# EAGLE design RH018.2 (EAGLE 7.1.0)
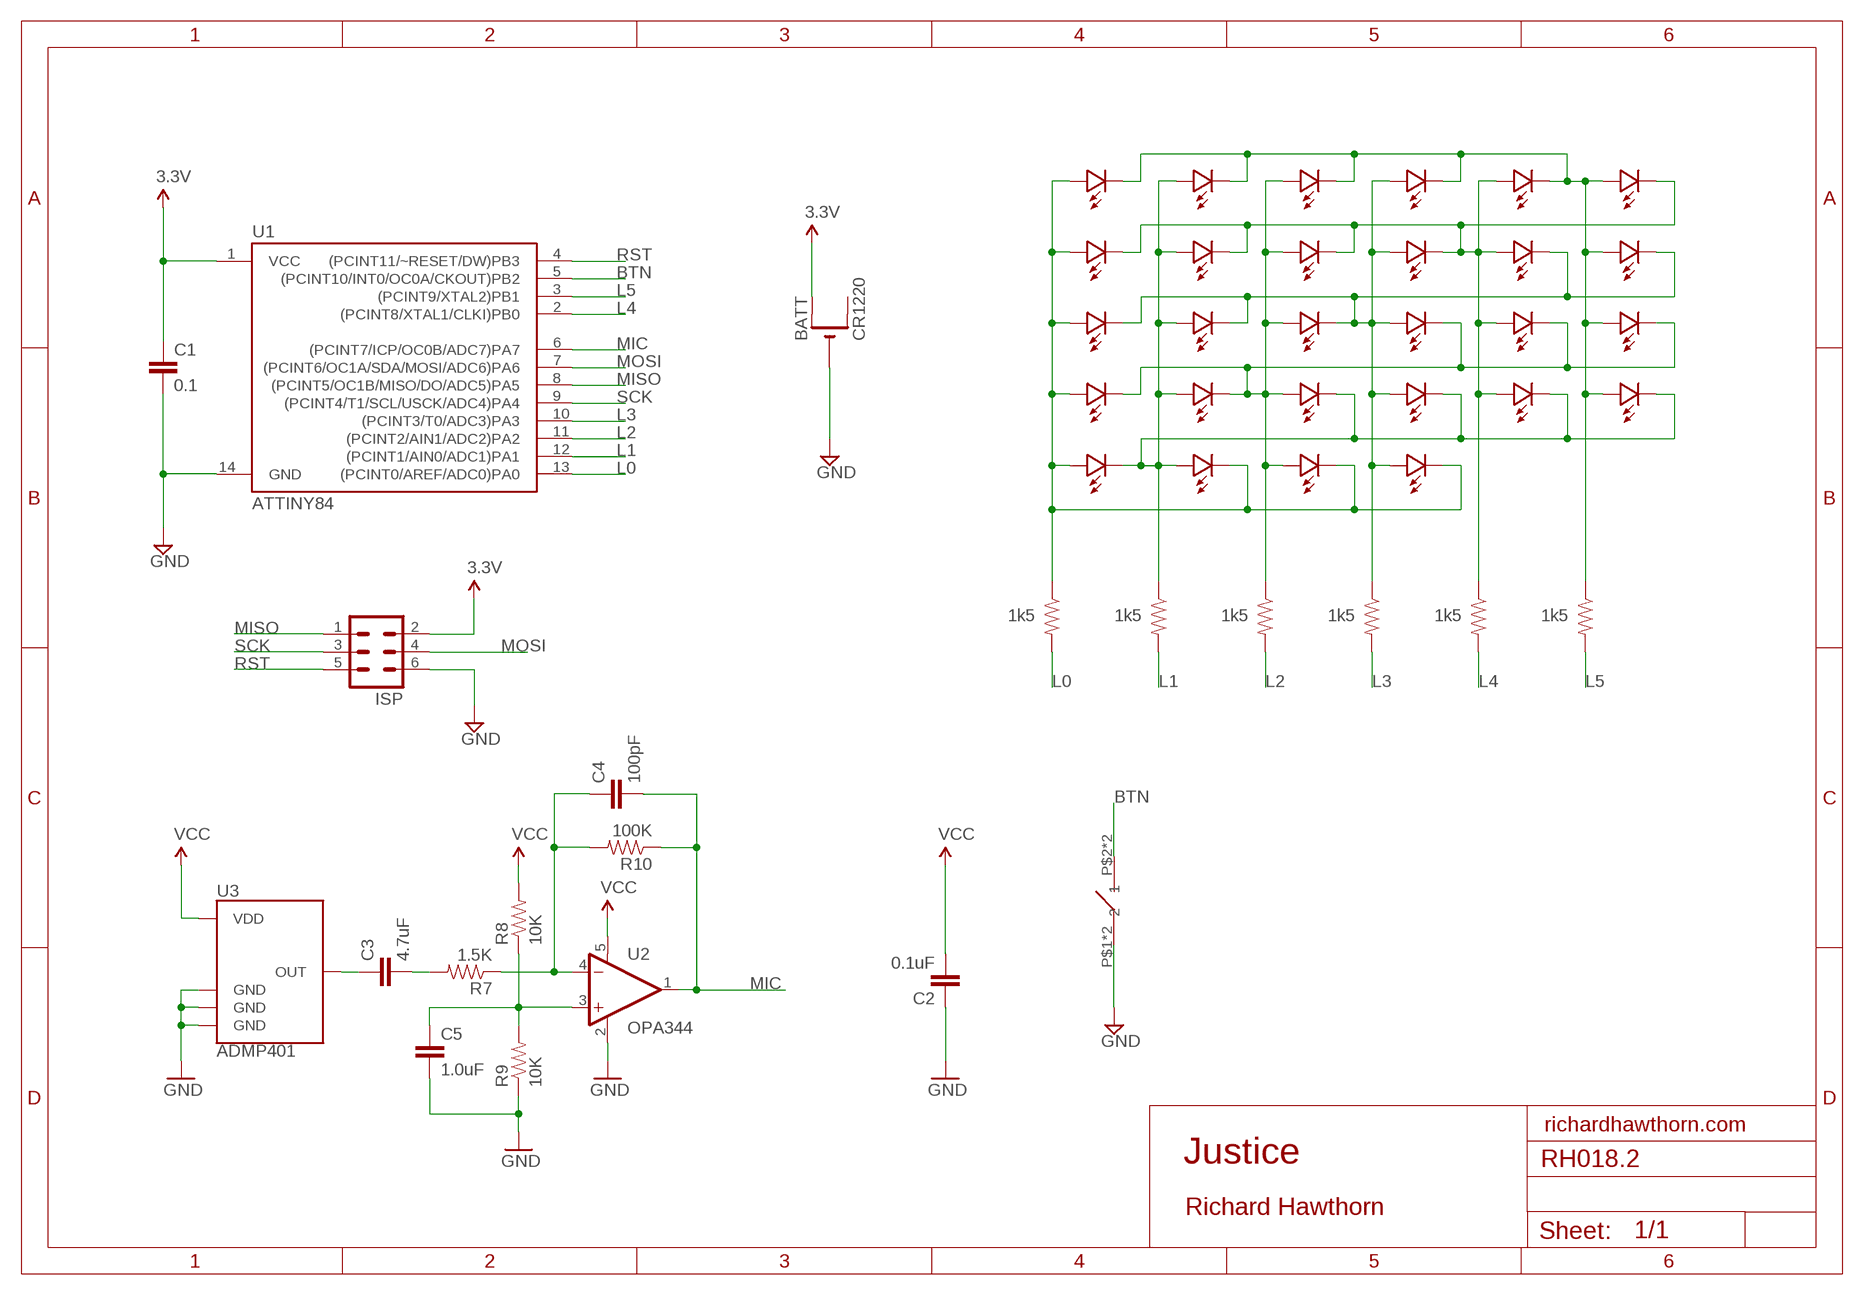
[diagram p0: schematic, sheet 1]

## Parts
BATT  CR1220  CR1220SMT  [CR1220-SMD]
BTN1  TURTLE-3PIN  [TURTLE-3PIN]
C1  0.1  CAP0603-CAP  [0603-CAP]
C2  0.1uF  CAP0402-CAP  [0402-CAP]
C3  4.7uF  CAP0402-CAP  [0402-CAP]
C4  100pF  CAP0402-CAP  [0402-CAP]
C5  1.0uF  CAP0402-CAP  [0402-CAP]
ISP  MA03-2  [MA03-2]
LED1  LED0603  [0603-LED]
LED2  LED0603  [0603-LED]
LED3  LED0603  [0603-LED]
LED4  LED0603  [0603-LED]
LED5  LED0603  [0603-LED]
LED6  LED0603  [0603-LED]
LED7  LED0603  [0603-LED]
LED8  LED0603  [0603-LED]
LED9  LED0603  [0603-LED]
LED10  LED0603  [0603-LED]
LED11  LED0603  [0603-LED]
LED12  LED0603  [0603-LED]
LED13  LED0603  [0603-LED]
LED14  LED0603  [0603-LED]
LED15  LED0603  [0603-LED]
LED16  LED0603  [0603-LED]
LED17  LED0603  [0603-LED]
LED18  LED0603  [0603-LED]
LED19  LED0603  [0603-LED]
LED20  LED0603  [0603-LED]
LED21  LED0603  [0603-LED]
LED22  LED0603  [0603-LED]
LED23  LED0603  [0603-LED]
LED24  LED0603  [0603-LED]
LED25  LED0603  [0603-LED]
LED26  LED0603  [0603-LED]
LED27  LED0603  [0603-LED]
LED28  LED0603  [0603-LED]
R1  1k5  RESISTOR0603-RES  [0603-RES]
R2  1k5  RESISTOR0603-RES  [0603-RES]
R3  1k5  RESISTOR0603-RES  [0603-RES]
R4  1k5  RESISTOR0603-RES  [0603-RES]
R5  1k5  RESISTOR0603-RES  [0603-RES]
R6  1k5  RESISTOR0603-RES  [0603-RES]
R7  1.5K  RESISTOR0402-RES  [0402-RES]
R8  10K  RESISTOR0402-RES  [0402-RES]
R9  10K  RESISTOR0402-RES  [0402-RES]
R10  100K  RESISTOR0402-RES  [0402-RES]
U1  ATTINY84  [SO14]
U2  OPA344  [SOT23-5]
U3  ADMP401  [ADMP401]

## Nets
BTN: BTN1.P$2 BTN1.P$4 U1.5((PCINT10/INT0/OC0A/CKOUT)PB2)
C7N$1: C3.1 U3.1(OUT)
GND [power]: BATT.- BTN1.P$1 BTN1.P$3 C1.2 C2.1 C5.2 ISP.6 R9.1 U1.14(GND) U2.2(V-) U3.2(GND) U3.4(GND) U3.6(GND)
L0: R1.2 U1.13((PCINT0/AREF/ADC0)PA0)
L1: R2.2 U1.12((PCINT1/AIN0/ADC1)PA1)
L2: R3.2 U1.11((PCINT2/AIN1/ADC2)PA2)
L3: R4.2 U1.10((PCINT3/T0/ADC3)PA3)
L4: R5.2 U1.2((PCINT8/XTAL1/CLKI)PB0)
L5: R6.2 U1.3((PCINT9/XTAL2)PB1)
MIC: C4.2 R10.1 U1.6((PCINT7/ICP/OC0B/ADC7)PA7) U2.1(OUT)
MISO: ISP.1 U1.8((PCINT5/OC1B/MISO/DO/ADC5)PA5)
MOSI: ISP.4 U1.7((PCINT6/OC1A/SDA/MOSI/ADC6)PA6)
N$2: C4.1 R7.1 R10.2 U2.4(-IN)
N$6: C3.2 R7.2
N$7: C5.1 R8.1 R9.2 U2.3(+IN)
N$8: LED1.MINUS LED2.MINUS LED3.MINUS LED4.MINUS LED5.MINUS LED6.PLUS LED12.PLUS LED18.PLUS LED24.PLUS R6.1
N$12: LED2.PLUS LED8.PLUS LED14.PLUS LED20.PLUS LED21.MINUS LED22.MINUS LED23.MINUS LED24.MINUS LED25.MINUS LED26.PLUS R2.1
N$22: LED1.PLUS LED7.PLUS LED13.PLUS LED19.PLUS LED25.PLUS LED26.MINUS LED27.MINUS LED28.MINUS R1.1
N$32: LED5.PLUS LED6.MINUS LED7.MINUS LED8.MINUS LED9.MINUS LED10.MINUS LED11.PLUS LED17.PLUS LED23.PLUS R5.1
N$41: LED4.PLUS LED10.PLUS LED11.MINUS LED12.MINUS LED13.MINUS LED14.MINUS LED15.MINUS LED16.PLUS LED22.PLUS LED28.PLUS R4.1
N$50: LED3.PLUS LED9.PLUS LED15.PLUS LED16.MINUS LED17.MINUS LED18.MINUS LED19.MINUS LED20.MINUS LED21.PLUS LED27.PLUS R3.1
RST: ISP.5 U1.4((PCINT11/~RESET/DW)PB3)
SCK: ISP.3 U1.9((PCINT4/T1/SCL/USCK/ADC4)PA4)
VCC: BATT.+$1(+) C1.1 C2.2 ISP.2 R8.2 U1.1(VCC) U2.5(V+) U3.5(VDD) ; supply symbol labelled 3.3V
Unconnected: BATT.+$2(+1)

## Notes on the sheet
- richardhawthorn.com
- Justice
- Richard Hawthorn

## Library data of the parts
BATT = adafruit:CR1220: CR1216/CR1220/CR1225 12mm 3V lithium coin cell Great for battery packup. Both SMT and THM holders. Note the THM package has the ground pads on both sides of the PCB so that the masks are the same - this reduces the cost
BTN1 = Richards:TURTLE-3PIN
C1 = LowPowerLab:CAP: Capacitor Standard 0603 ceramic capacitor, and 0.1" leaded capacitor.
C2-C5 = SparkFun:CAP: Capacitor Standard 0603 ceramic capacitor, and 0.1" leaded capacitor.
ISP = Richards:MA03-2: PIN HEADER; OC_FARNELL: unknown; OC_NEWARK: unknown
LED1-LED28 = LowPowerLab:LED
R1-R6 = LowPowerLab:RESISTOR: Resistor
R7-R10 = SparkFun:RESISTOR: Resistor
U1 = SparkFun-DigitalIC:ATTINY84: Atmel 14-pin 2/4/8kB flash uC
U2 = SparkFun:OPA344
U3 = SparkFun:ADMP401

## Net classes
1 power: width 0.381 mm, clearance 0.254 mm

## Board
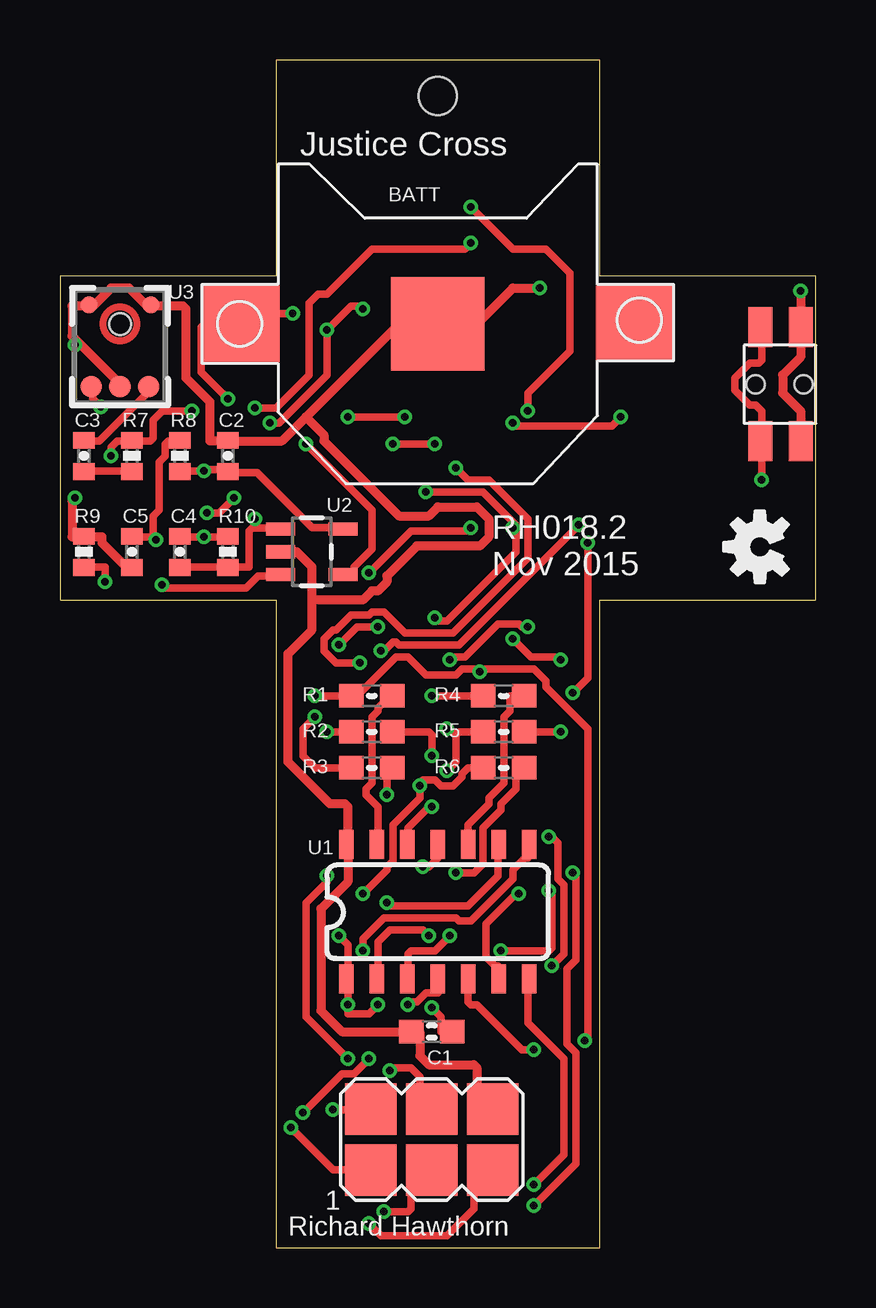
[diagram p1: board, top side]
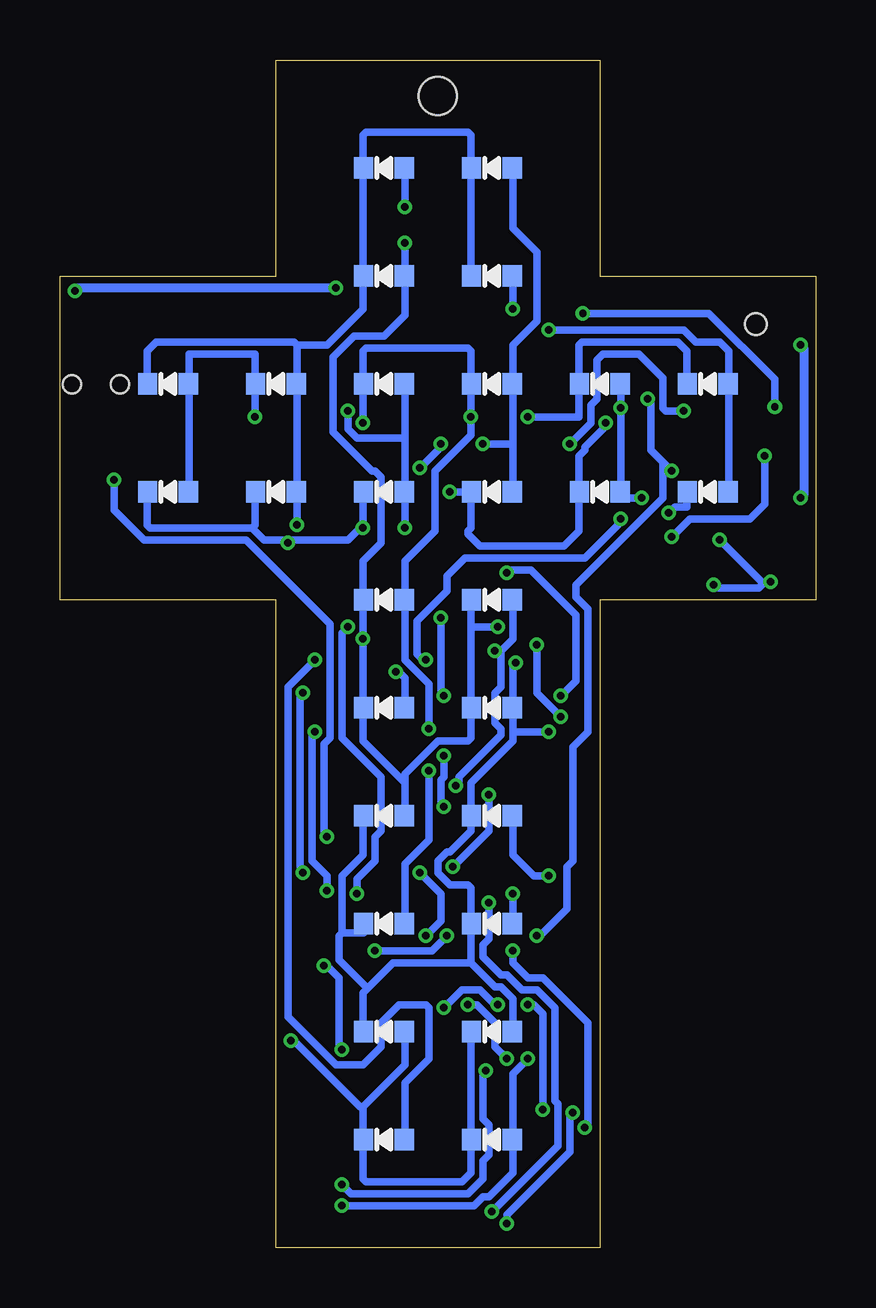
[diagram p2: board, bottom side, seen from below]

Size 31.5 x 49.5 mm. Coordinates in mm from the lower left corner, seen from the top.
Outline: 31.5,27 31.5,40.5 22.5,40.5 22.5,49.5 9,49.5 9,40.5 0,40.5 0,27 9,27 9,0 22.5,0 22.5,27 31.5,27
Copper layers (1*16): Top 0.035mm / dielectric 1.5mm / Bottom 0.035mm
Design rules "ITEADstudio_DRC *": minimum track width 12mil, minimum drill 12mil, track to track 6mil, track to pad 6mil, pad to pad 6mil, via to via 6mil, smd to smd 0mil, copper to edge 10mil, drill to drill 10mil, minimum pad ring 10mil, minimum via ring 6mil, stop-mask expansion 2mil, vias tented up to drill 100mil, thermal gap 15mil
Holes 1.6 mm at 15.75,48
tRestrict: area 22.8,8.4 to 27.6,12.3; area 4.3,16.4 to 5.4,18; area 3.7,9.2 to 5.2,9.9
bRestrict: area 25.9,17.2 to 27.7,18.2; area 19.6,13.3 to 21.4,14.4; area 20.1,12.1 to 20.6,12.7; area 19.2,12.1 to 19.7,12.7; area 18.7,12.3 to 19.2,13; area 18.6,12.9 to 19.1,13.5; area 25,18.4 to 25.6,19; area 25,17.4 to 25.6,18; area 26,18.6 to 26.5,19.3; area 26.4,18.3 to 27.6,19.1

### Footprints (pad centres in the part's own frame; a part is rotated, then mirrored left to right if it is on the bottom)
CR1220-SMD = smd 3.2 x 3.2: +$1 -8.2,0; +$2 8.2,0 | smd 3.9 x 3.9: - 0,0
TURTLE-3PIN = smd 1.676 x 1: P$1 -2.39,-0.889; P$2 -2.39,0.811; P$3 2.36,-0.889; P$4 2.36,0.811 | hole 0.75: -0.015,-1; -0.015,1
0603-CAP = smd 1.016 x 0.965: 1 -0.85,0; 2 0.85,0
0402-CAP = smd 0.7 x 0.9: 1 -0.65,0; 2 0.65,0
MA03-2 = smd 2.159 x 2.159: 1 -2.54,-1.27; 2 -2.54,1.27; 3 0,-1.27; 4 0,1.27; 5 2.54,-1.27; 6 2.54,1.27
0603-LED = smd 0.8 x 0.9: MINUS -0.85,0; PLUS 0.85,0
0603-RES = smd 1.016 x 0.965: 1 -0.85,0; 2 0.85,0
0402-RES = smd 0.7 x 0.9: 1 -0.65,0; 2 0.65,0
SO14 = smd 0.6 x 1.2: 1 -3.81,-2.8; 2 -2.54,-2.8; 3 -1.27,-2.8; 4 0,-2.8; 5 1.27,-2.8; 6 2.54,-2.8; 7 3.81,-2.8; 8 3.81,2.8; 9 2.54,2.8; 10 1.27,2.8; 11 0,2.8; 12 -1.27,2.8; 13 -2.54,2.8; 14 -3.81,2.8
SOT23-5 = smd 0.55 x 1.2: 1 -0.95,-1.3; 2 0,-1.3; 3 0.95,-1.3; 4 0.95,1.3; 5 -0.95,1.3
ADMP401 = smd 0.9 x 0.9: 1 -1.2,2.62; 5 1.2,2.62; 6 0,2.62 | smd 0.7 x 0.7: 2 1.3,-0.8; 4 -1.3,-0.8 | hole 0.9: 0,0

### Placement (x,y rotation side)
BATT  15.75,38.5 0 top
BTN1  30,36 90 top
C1  15.5,9 180 top
C2  7,33 270 top
C3  1,33 270 top
C4  5,29 270 top
C5  3,29 270 top
ISP  15.5,4.5 0 top
LED1  18,45 0 bottom
LED2  13.5,45 0 bottom
LED3  18,40.5 0 bottom
LED4  13.5,40.5 0 bottom
LED5  27,36 0 bottom
LED6  22.5,36 0 bottom
LED7  18,36 0 bottom
LED8  13.5,36 0 bottom
LED9  9,36 0 bottom
LED10  4.5,36 0 bottom
LED11  27,31.5 0 bottom
LED12  22.5,31.5 0 bottom
LED13  18,31.5 0 bottom
LED14  13.5,31.5 0 bottom
LED15  9,31.5 0 bottom
LED16  4.5,31.5 0 bottom
LED17  18,27 0 bottom
LED18  13.5,27 0 bottom
LED19  18,22.5 0 bottom
LED20  13.5,22.5 0 bottom
LED21  18,18 0 bottom
LED22  13.5,18 0 bottom
LED23  18,13.5 0 bottom
LED24  13.5,13.5 0 bottom
LED25  18,9 0 bottom
LED26  13.5,9 0 bottom
LED27  18,4.5 0 bottom
LED28  13.5,4.5 0 bottom
R1  13,23 0 top
R2  13,21.5 0 top
R3  13,20 0 top
R4  18.5,23 0 top
R5  18.5,21.5 0 top
R6  18.5,20 0 top
R7  3,33 270 top
R8  5,33 270 top
R9  1,29 270 top
R10  7,29 90 top
U1  15.75,14 0 top
U2  10.5,29 270 top
U3  2.5,38.5 180 top
U$3  [OSHW-LOGO-S]  29.17,29.21 90 top

### Tracks (layer width: path | path; a pad name or v marks a point on that pad's centre or on a via)
BTN  (via drill 0.3)
  Top 0.305: BTN1.P$4 29.25,38.25 29.25,37 29.12,36.88 28.75,36.88 28.12,36.25 28.12,35.75 28.75,35.12 29,35.12 29.25,34.88 29.25,33.62 BTN1.P$2 29.25,33.5 v29.25,32 | v19.75,8.25 19.25,8.25 17.38,10.12 17.12,10.12 17,10.25 17,11.12 U1.5 | v20.5,11.75 21,12.25 21,15.12 20.75,15.38 20.75,16.88 20.5,17.12 v20.38,17.12
  Bottom 0.305: v19.75,8.25 19.88,8.38 19.88,11.25 20.38,11.75 v20.5,11.75 | v20.38,17.12 20.5,17.25 20.5,21 20.25,21.25 20.25,26 23.75,29.5 28,29.5 29.25,30.75 v29.25,32
C7N$1
  Top 0.305: C3.1 1,33.62 1.62,33.62 3.88,35.88 3.75,36 U3.1
GND  (via drill 0.3)
  Top 0.381: U2.2 9.88,29 10.5,28.38 10.5,27 | 10.5,27 10.5,25.75 9.5,24.75 9.5,20.25 11.25,18.5 11.88,18.5 12,18.38 12,16.88 U1.14 12,16.75 12,15.25 10.88,14.12 10.88,9.88 11.75,9 C1.2 15,9 15,8 15.38,7.62 17.25,7.62 17.38,7.5 17.38,5.75 18,5.75 ISP.6 | C5.2 3,28.38 2.75,28.38 1.75,29.38 1.75,29.62 1,29.62 R9.1 0.88,29.62 0.5,29.62 0.5,31.12 v0.62,31.25 | 0.75,37.75 0.5,38 0.5,39.25 1.12,39.25 U3.2 1.25,39.25 1.38,39.25 2.12,40 2.88,40 3.62,39.25 3.75,39.25 U3.4 3.88,39.25 5.12,39.25 5.25,39.12 5.25,36.25 6.25,35.25 6.25,33.62 6.88,33.62 C2.1 7,33.62 9.25,33.62 10.25,34.62 | 0.75,37.75 2.5,36 U3.6 | v0.62,37.62 0.75,37.75 | BTN1.P$1 30.88,33.62 30.88,34.88 30.12,35.62 30.12,36.38 30.88,37.12 30.88,38.25 BTN1.P$3 30.88,38.5 v30.88,39.88 | 10.25,34.62 14.12,38.5 BATT.- 17.38,38.5 18.88,40 v20,40 | 10.5,27 12.62,27 13,27.38 13.25,27.38 13.62,27.75 13.62,28 14.88,29.25 17.5,29.25 17.88,29.62 17.88,30.38 17.38,30.88 15.75,30.88 15.38,30.5 14.12,30.5 11,33.62 11,33.88 10.25,34.62
  Bottom 0.381: v0.62,31.25 0.5,31.38 0.5,37.5 v0.62,37.62 | v30.88,39.88 30.75,40 v20,40
L0
  Top 0.305: R1.2 13.75,23 13.25,22.5 13.25,22.38 13,22.12 13,19.38 12.75,19.12 12.75,18.88 13.25,18.38 13.25,16.88 U1.13
L1  (via drill 0.3)
  Top 0.305: v15.5,18.38 15.38,18.38 14.5,17.5 14.5,16.88 U1.12 | v15.5,20.5 15.5,21.38 15.38,21.5 R2.2
  Bottom 0.305: v15.5,18.38 15.62,18.5 15.62,19.5 15.5,19.62 v15.5,20.5
L2  (via drill 0.3)
  Top 0.305: U1.11 15.75,16.25 15.38,15.88 v15.12,15.88 | v13.62,18.88 13.62,20 R3.2
  Bottom 0.305: v15.12,15.88 13.62,17.38 v13.62,18.88
L3
  Top 0.305: R4.2 18.75,23 18.75,22.38 18.5,22.12 18.5,19.38 17.88,18.75 17.88,18.5 17,17.62 17,16.88 U1.10
L4  (via drill 0.3)
  Top 0.305: v15.38,13 15.12,13.25 13.75,13.25 13.25,12.75 13.25,11.25 U1.2 | v18.38,12.38 20.38,12.38 20.5,12.5 20.5,14.75 v20.38,14.88 | R5.2 v20.88,21.5
  Bottom 0.305: v15.38,13 16,12.38 v18.38,12.38 | v20.38,14.88 20.38,15.5 21,16.12 21,21.38 v20.88,21.5
L5  (via drill 0.3)
  Top 0.305: R6.2 19,20 19,19.12 18.38,18.5 18.38,18.25 17.62,17.5 17.62,16 17.25,15.62 v16.5,15.62 | v16.25,13 15.62,12.38 14.62,12.38 14.5,12.25 14.5,11.25 U1.3
  Bottom 0.305: v16.5,15.62 15.62,14.75 15.62,13.62 v16.25,13
MIC  (via drill 0.3)
  Top 0.305: C4.2 5,28.38 7,28.38 R10.1 7.12,28.38 7.88,28.38 7.88,29.88 8,30 8.12,30 | 8.12,30 9.12,30 U2.1 | v19.12,14.75 19,14.75 17.75,13.5 17.75,12.12 18.12,11.75 18.25,11.75 18.25,11.25 U1.6 | v19.5,25.88 19.25,25.88 19.12,26 18.25,26 16.88,24.62 16.38,24.62 v16.25,24.5 | 8.12,30 v8.12,30.38
  Bottom 0.305: v19.12,14.75 19.12,15.38 18.38,16.12 18.38,17.12 18.12,17.38 18.12,19.62 19.75,21.25 19.75,25.62 v19.5,25.88 | v16.25,24.5 16.38,24.5 16.62,24.75 16.62,26.12 15.38,27.38 15.38,28 14.62,28.75 9.62,28.75 8.25,30.12 8.25,30.25 v8.12,30.38
MISO  (via drill 0.3)
  Top 0.305: v12.62,12.38 12.62,12.88 13.5,13.75 16.5,13.75 16.62,13.62 17.12,13.62 18.88,15.38 18.88,15.75 19.38,16.25 19.5,16.25 19.5,16.75 U1.8 | v9.62,5 11.38,3.25 12.88,3.25 ISP.1
  Bottom 0.305: v12.62,12.38 12.62,11.88 12,11.25 11.38,11.25 9.5,9.38 9.5,5.12 v9.62,5
MOSI  (via drill 0.3)
  Top 0.305: v19.75,2.62 21,3.88 21,7.88 19.5,9.38 19.5,11.12 U1.7 | v13.75,7.38 13.88,7.5 14.62,7.5 15,7.12 15,5.75 15.5,5.75 ISP.4
  Bottom 0.305: v19.75,2.62 19.38,2.25 14.5,2.25 13.88,2.88 13.88,3.62 13.62,3.88 13.62,5.12 13.88,5.38 13.88,7.25 v13.75,7.38
N$2  (via drill 0.3)
  Top 0.305: C4.1 5,29.62 v6,29.62 7,29.62 R10.2 | v2.12,33 2.12,33.38 2.38,33.62 3,33.62 R7.1 3.12,33.62 3.75,33.62 3.88,33.75 3.88,34.5 4.25,34.88 v5.5,34.88 | v10.25,33.5 13,30.75 13,29.12 12.25,28.38 12.25,28 11.88,28 U2.4
  Bottom 0.305: v2.12,33 2.12,31 2.75,30.38 5.25,30.38 v6,29.62 | v10.25,33.5 9.38,34.38 9.38,35.12 9.12,35.38 9.12,37 8.88,37.25 7.38,37.25 6.38,36.25 6.38,35 6.25,34.88 v5.5,34.88
N$6
  Top 0.305: C3.2 1,32.38 3,32.38 R7.2
N$7  (via drill 0.3)
  Top 0.305: v1.88,27.75 1.88,28.38 1,28.38 R9.2 | C5.1 3,29.62 3.88,29.62 v4,29.5 3.88,29.75 3.88,30.5 4.12,30.75 4.12,32.75 4.38,33 4.38,33.5 4.5,33.62 5,33.62 R8.1 | v4.25,27.62 4.38,27.5 7.75,27.5 8.25,28 9.12,28 U2.3
  Bottom 0.305: 2.25,27.75 v1.88,27.75 | v4,29.5 2.25,27.75 | v4.25,27.62 4.12,27.5 2.38,27.5 2.25,27.62 2.25,27.75
N$8  (via drill 0.3)
  Top 0.305: v12.62,14.75 13.62,15.75 13.62,15.88 13.88,16.12 13.88,17.62 15,18.75 v15,19.25 15,19.38 15.12,19.5 15.62,19.5 15.88,19.25 16.38,19.25 16.75,19.62 16.75,19.75 17,20 R6.1 | v13.38,24.88 13.5,24.88 13.88,25.25 14,25.25 14.12,25.12 16.62,25.12 v21.62,30.12
  Bottom 0.305: v12.62,14.75 12.62,13.5 LED24.PLUS | v15,19.25 14.88,19.38 14.88,19.62 13.12,21.38 13.12,21.62 13.38,21.88 13.38,23.12 13.12,23.38 13.12,24.88 | 13.12,24.88 12.62,25.38 12.62,27 LED18.PLUS | LED4.MINUS 14.38,40.5 14.38,45 LED2.MINUS 14.38,45.12 14.38,46.38 14.5,46.5 18.75,46.5 18.88,46.38 18.88,45.12 LED1.MINUS 18.88,45 18.88,40.5 LED3.MINUS 18.88,40.38 18.88,39.12 20.38,37.62 21.62,37.62 | 21.62,37.62 21.75,37.75 27.5,37.75 27.88,37.38 27.88,36 LED5.MINUS | 21.62,37.62 21.62,36.12 LED6.PLUS 21.62,36 21.62,31.5 LED12.PLUS 21.62,31.38 v21.62,30.12 | v13.38,24.88 13.12,24.88
N$12  (via drill 0.3)
  Top 0.305: v11.12,21.5 R2.1 | v15.62,33.5 v13.88,33.5 | v16.5,32.5 17,32 17.88,32 19.5,30.38 19.5,28.75 16.38,25.62 14.38,25.62 13.5,26.5 13,26.5 12.88,26.38 12.12,26.38 11.5,25.75 11.38,25.75 11,25.38 11,24.88 11.5,24.38 v12.5,24.38
  Bottom 0.305: 12.62,33.5 12.62,36 LED8.PLUS 12.62,36.12 12.62,37.62 11.62,38.62 11.62,41.5 12.62,42.5 12.62,45 LED2.PLUS | 12.62,33.5 12.62,31.5 LED14.PLUS | 12.62,21.5 12.62,21.12 14.38,19.38 14.38,18 LED22.MINUS 14.38,17.88 14.38,17.38 15.25,16.5 15.38,16.5 15.75,16.12 15.75,15.62 15.25,15.12 14.5,15.12 14.38,15 14.38,13.62 LED24.MINUS 14.38,13.5 14.38,11.88 | 12.62,21.5 12.62,22.5 LED20.PLUS 12.62,22.62 12.62,24.25 v12.5,24.38 | 12.62,21.5 v11.12,21.5 | 14.38,11.88 13.38,10.88 13.12,10.88 12.62,10.38 12.62,9 LED26.PLUS | 18.69,10.81 17.62,11.88 14.38,11.88 | 18.69,10.81 18.88,10.62 18.88,9 LED25.MINUS | 19.75,13.12 19.75,15.5 18.88,16.38 18.88,18 LED21.MINUS | 19.75,13.12 19.88,13 19.88,12 18.69,10.81 | v13.88,33.5 12.62,33.5 | v15.62,33.5 15.62,33.38 v16.5,32.5 | 19.75,13.12 18.85,13.12 LED23.MINUS
N$22  (via drill 0.3)
  Top 0.305: v17.12,43.38 18.88,41.62 20.25,41.62 21.25,40.62 21.25,37.38 19.5,35.62 v19.5,34.88 | v10.62,23 R1.1 12.38,23 14,24.62 14.5,24.62 15.25,23.88 16.5,23.88 16.75,24.12 17.38,24.12 v17.5,24 17.5,24.12 19.75,24.12 20.25,23.62 20.25,23.38 22,21.62 22,8.75 v21.88,8.62 | v12.88,28.12 14.62,29.88 17,29.88 v17.12,30
  Bottom 0.305: LED26.MINUS 14.38,9 14.38,4.5 LED28.MINUS 14.38,4.38 14.38,3.12 14.75,2.75 18.75,2.75 18.88,2.88 18.88,4.38 LED27.MINUS 18.88,4.5 18.88,5.88 | 18.88,5.88 17.12,7.62 17.12,9 LED25.PLUS | v17.5,24 17.38,24 17.12,23.75 17.12,22.5 LED19.PLUS | 17.12,33.75 17.12,31.5 LED13.PLUS 17.12,31.38 v17.12,30 | 17.12,33.75 17.12,36 LED7.PLUS | v17.12,43.38 17.12,45 LED1.PLUS | v19.5,34.88 19.5,34.12 19.12,33.75 17.12,33.75 | v10.62,23 10,23.62 10,26.38 11.88,28.25 12.75,28.25 v12.88,28.12 | v21.88,8.62 21.75,8.62 19,5.88 18.88,5.88
N$32  (via drill 0.3)
  Top 0.305: v16.12,19.88 16.5,20.25 16.5,21.38 | 16.5,21.38 16.62,21.5 R5.1 | v16.12,21.62 16.25,21.5 16.5,21.5 16.5,21.38 | v14.38,34.62 v12,34.62 | v23.38,34.62 23,34.25 19,34.25 v18.88,34.38
  Bottom 0.305: LED11.PLUS 26.12,31.5 26.12,36 LED5.PLUS 26.12,36.12 26.12,37.25 23.38,37.25 23.38,36 LED6.MINUS 23.38,35.88 v23.38,34.62 | LED10.MINUS 5.38,36 5.38,37.38 5.75,37.75 9.75,37.75 9.88,37.62 9.88,36 LED9.MINUS 9.88,35.88 9.88,34.62 v12,34.62 | v16.12,19.88 16.12,17 17.12,16 17.12,13.5 LED23.PLUS | v16.12,21.62 16.12,23.5 17.12,24.5 17.12,27 LED17.PLUS 17.12,27.12 17.12,28.62 15.88,29.88 15.88,32.38 14.38,33.88 v14.38,34.62 14.38,35.88 LED8.MINUS 14.38,36 14.38,37.38 14.5,37.5 18.75,37.5 18.88,37.38 18.88,36 LED7.MINUS 18.88,35.88 v18.88,34.38
N$41  (via drill 0.3)
  Top 0.305: v12.62,39.12 12.5,39.25 12.12,39.25 v11.12,38.25 11.12,36.38 9.12,34.38 v8.75,34.38 | v12,7.88 10.25,9.62 10.25,14.38 11.12,15.25 v11.12,15.5 | v15.5,23 R4.1 | v15.62,26.25 15.75,26.12 16.12,26.12 19,29 19,29.88 v18.88,30 19,30 19,30.12 17.62,31.5 v15.25,31.5 | v19.75,1.75 21.5,3.5 21.5,8.12 21.12,8.5 21.12,11.62 21.5,12 21.5,15.5 v21.38,15.62 | v21.38,23.12 22,23.75 v22,29.38
  Bottom 0.305: LED16.PLUS 3.62,31.5 3.62,36 LED10.PLUS 3.62,36.12 3.62,37.38 4,37.75 5,37.75 5.5,38.25 v11.12,38.25 | v12.62,39.12 12.62,40.5 LED4.PLUS | v12,7.88 12.62,7.25 12.62,4.5 LED28.PLUS 12.62,4.38 12.62,3.12 13.62,2.12 13.88,2.12 14.25,1.75 v19.75,1.75 | v11.12,15.5 11.75,15.5 12.62,16.38 12.62,18 LED22.PLUS | 23.5,30 27.75,30 27.88,30.12 27.88,31.5 LED11.MINUS | 23.5,30 23.38,30.12 23.38,31.5 LED12.MINUS | 18.88,30.12 18.88,31.5 LED13.MINUS | 18.88,30.12 19.5,29.5 22,29.5 | 22,29.5 23,29.5 23.5,30 | v15.5,23 15.62,23.12 v15.62,26.25 | v18.88,30 18.88,30.12 | v15.25,31.5 LED14.MINUS 14.38,31.5 14.38,30 14.5,29.88 14.5,29.75 14,29.25 10.5,29.25 9.88,29.88 9.88,31.5 LED15.MINUS 9.88,31.62 9.88,33 9.62,33.25 9.62,33.38 8.75,34.25 v8.75,34.38 | v21.38,15.62 21.38,15.75 21.5,15.88 21.5,23 v21.38,23.12 | v22,29.38 22,29.5
N$50  (via drill 0.3)
  Top 0.305: v6.12,30.62 6.62,30.62 v7.25,31.25 | v17.12,41.88 16.88,41.62 13,41.62 11.12,39.75 10.75,39.75 10.38,39.38 10.38,36.38 9,35 v8.12,35 | R3.1 10.62,20 10.12,20.5 10.12,21.62 v10.62,22.12 | v11.62,25.12 12.38,25.88 v13.25,25.88 | v20.88,24.5 20.75,24.5 20.62,24.62 19.62,24.62 v18.88,25.38
  Bottom 0.305: v6.12,30.62 5.88,30.88 5.38,30.88 5.38,31.5 LED16.MINUS | v7.25,31.25 8.12,31.25 8.12,31.5 LED15.PLUS 8.12,31.62 v8.12,35 8.12,36 LED9.PLUS | v17.12,41.88 17.12,40.5 LED3.PLUS 17.12,40.38 17.12,38.88 18,38 19.25,38 20.12,37.12 20.12,34 18.5,32.38 18.38,32.38 18.12,32.12 18.12,29.38 18.88,28.62 18.88,27.12 LED17.MINUS 18.88,27 v18.88,25.38 18.88,22.62 LED19.MINUS 18.88,22.5 18.88,21.12 17.12,19.38 | 17.12,19.38 17.12,18 LED21.PLUS | 14.38,25.88 14.38,27 LED18.MINUS | 14.38,25.88 14.38,22.5 LED20.MINUS 14.38,22.38 14.38,21.25 14.5,21.12 15.75,21.12 17.12,19.75 17.12,19.38 | v10.62,22.12 11.62,23.12 v11.62,25.12 | 14.38,25.88 v13.25,25.88 | v20.88,24.5 22,23.38 22,9.62 20,7.62 18.88,7.62 18.12,8.38 18.12,9.38 17.38,10.12 16.25,10.12 16.12,10 16.12,7.88 17.12,6.88 17.12,4.5 LED27.PLUS
RST  (via drill 0.3)
  Top 0.305: U1.4 15.75,10.62 15.25,10.62 14.88,10.25 14.62,10.25 v14.5,10.12 | v12.88,7.88 12.25,7.25 11.75,7.25 v10.12,5.62 | v12.88,1 13.38,0.5 16.12,0.5 17.25,1.62 17.25,3.25 18,3.25 ISP.5
  Bottom 0.305: v14.5,10.12 14.12,10.12 13.38,9.38 13.38,8.38 v12.88,7.88 | v10.12,5.62 10.25,5.5 10.25,4 12.88,1.38 v12.88,1
SCK  (via drill 0.3)
  Top 0.305: v13.62,14.38 13.75,14.25 17,14.25 18.25,15.5 18.25,16.75 U1.9 | v13.5,1.5 14.5,1.5 14.62,1.62 14.62,3.25 15.5,3.25 ISP.3
  Bottom 0.305: v13.62,14.38 13.62,12.88 13.88,12.62 13.88,12.12 13.12,11.38 12.88,11.38 12.25,10.75 11.62,10.75 10.88,10 10.88,6.12 10.75,6 10.75,4.25 v13.5,1.5
VCC  (via drill 0.3)
  Top 0.305: C1.1 15.88,9 15.88,9.62 v15.5,10 | v13.25,10.12 12.88,9.75 12,9.75 v12,10.12 12,11.12 U1.1 12,11.25 12,12.62 v11.62,13 | v11.38,5.75 12.88,5.75 ISP.2 | v7,35.38 5.88,36.5 5.88,38.38 6,38.5 BATT.+$1 7.64,38.59 7.99,38.93 v9.7,38.93 | R8.2 5,32.38 v6,32.38 6.04,32.42 6.96,32.42 C2.2 7.07,32.3 8.22,32.3 10.5,30.02 11.76,30.02 U2.5 | v1.7,35.05 1.36,35.39 1.36,35.85 U3.5
  Bottom 0.305: v15.5,10 14.75,10.75 14,10.75 13.38,10.12 v13.25,10.12 | v11.38,5.75 11.38,9.75 11.75,10.12 v12,10.12 | v7,35.38 6.88,35.25 6.88,33.25 6.31,32.69 | v6,32.38 6.31,32.69 | v11.62,13 11.5,13 10.38,14.12 10.38,15.88 10.12,16.12 10.12,20.88 9.5,21.5 9.5,26.62 10,27.12 10,27.62 6.38,31.25 6.38,32.62 6.31,32.69 | v1.7,35.05 1.7,36.19 4.44,38.93 v9.7,38.93

### Text on the board
tNames: Justice Cross | RH018.2 / Nov 2015 | Richard Hawthorn
tDocu: REG